# EAGLE schematic flukso.sensor.board.v2.0 (EAGLE 5.04)
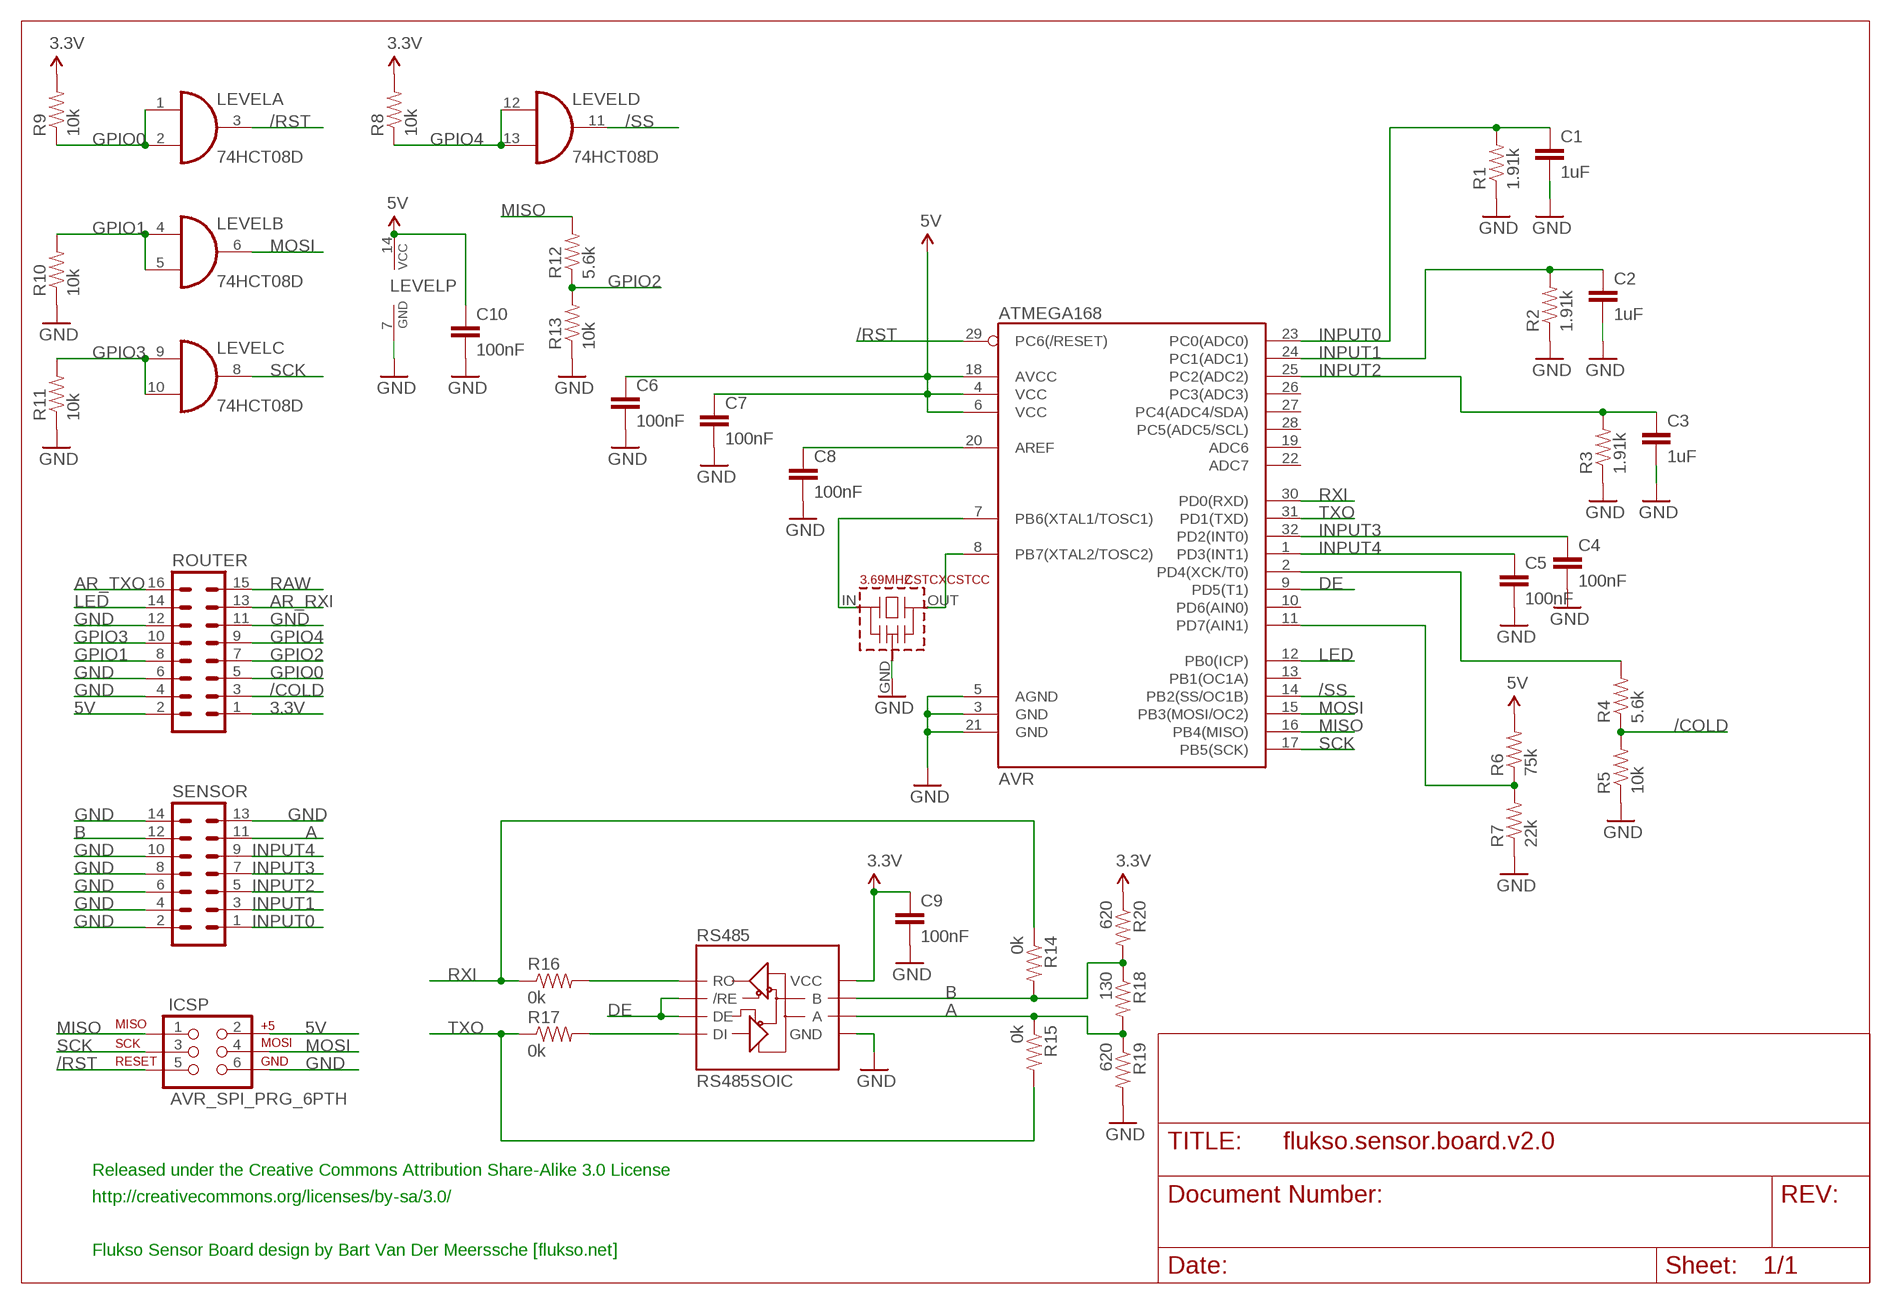
[diagram p0: schematic, sheet 1]

## Parts
3.69MHZ  CSTCXCSTCC  [CSTCC]
AVR  ATMEGA168  [TQFP32-08]
C1  1uF  CAP0402-CAP  [0402-CAP]
C2  1uF  CAP0402-CAP  [0402-CAP]
C3  1uF  CAP0402-CAP  [0402-CAP]
C4  100nF  CAP0402-CAP  [0402-CAP]
C5  100nF  CAP0402-CAP  [0402-CAP]
C6  100nF  CAP0402-CAP  [0402-CAP]
C7  100nF  CAP0402-CAP  [0402-CAP]
C8  100nF  CAP0402-CAP  [0402-CAP]
C9  100nF  CAP0402-CAP  [0402-CAP]
C10  100nF  CAP0402-CAP  [0402-CAP]
ICSP  AVR_SPI_PRG_6PTH  [2X3]
LEVEL  74HCT08D  [SO14]
R1  1.91k  RESISTOR0402-RES  [0402-RES]
R2  1.91k  RESISTOR0402-RES  [0402-RES]
R3  1.91k  RESISTOR0402-RES  [0402-RES]
R4  5.6k  RESISTOR0402-RES  [0402-RES]
R5  10k  RESISTOR0402-RES  [0402-RES]
R6  75k  RESISTOR0402-RES  [0402-RES]
R7  22k  RESISTOR0402-RES  [0402-RES]
R8  10k  RESISTOR0402-RES  [0402-RES]
R9  10k  RESISTOR0402-RES  [0402-RES]
R10  10k  RESISTOR0402-RES  [0402-RES]
R11  10k  RESISTOR0402-RES  [0402-RES]
R12  5.6k  RESISTOR0402-RES  [0402-RES]
R13  10k  RESISTOR0402-RES  [0402-RES]
R14  0k  RESISTOR0402-RES  [0402-RES]
R15  0k  RESISTOR0402-RES  [0402-RES]
R16  0k  RESISTOR0402-RES  [0402-RES]
R17  0k  RESISTOR0402-RES  [0402-RES]
R18  130  RESISTOR0402-RES  [0402-RES]
R19  620  RESISTOR0402-RES  [0402-RES]
R20  620  RESISTOR0402-RES  [0402-RES]
ROUTER  MA08-2  [MA08-2]
RS485  RS485SOIC  [SO08]
SENSOR  MA07-2  [MA07-2]

## Nets
3.3V: C9.1 R8.2 R9.2 R20.1 ROUTER.1 RS485.8(VCC)
5V: AVR.4(VCC) AVR.6(VCC) AVR.18(AVCC) C6.1 C7.1 C10.1 ICSP.2 LEVEL.14(P:VCC) R6.2 ROUTER.2
/COLD: R4.1 R5.2 ROUTER.3
/RST: AVR.29(PC6(/RESET)) ICSP.5 LEVEL.3(A:O)
/SS: AVR.14(PB2(SS/OC1B)) LEVEL.11(D:O)
A: R15.1 R18.2 R19.1 RS485.6(A) SENSOR.11
AR_RXI: ROUTER.13
AR_TXO: ROUTER.16
B: R14.2 R18.1 R20.2 RS485.7(B) SENSOR.12
DE: AVR.9(PD5(T1)) RS485.2(/RE) RS485.3(DE)
GND: 3.69MHZ.GND(VSS) AVR.3(GND) AVR.5(AGND) AVR.21(GND) C1.2 C2.2 C3.2 C4.2 C5.2 C6.2 C7.2 C8.2 C9.2 C10.2 ICSP.6 LEVEL.7(P:GND) R1.1 R2.1 R3.1 R5.1 R7.1 R10.1 R11.1 R13.1 R19.2 ROUTER.4 ROUTER.6 ROUTER.11 ROUTER.12 RS485.5(GND) SENSOR.2 SENSOR.4 SENSOR.6 SENSOR.8 SENSOR.10 SENSOR.13 SENSOR.14
GPIO0: LEVEL.1(A:I0) LEVEL.2(A:I1) R9.1 ROUTER.5
GPIO1: LEVEL.4(B:I0) LEVEL.5(B:I1) R10.2 ROUTER.8
GPIO2: R12.1 R13.2 ROUTER.7
GPIO3: LEVEL.9(C:I0) LEVEL.10(C:I1) R11.2 ROUTER.10
GPIO4: LEVEL.12(D:I0) LEVEL.13(D:I1) R8.1 ROUTER.9
INPUT0: AVR.23(PC0(ADC0)) C1.1 R1.2 SENSOR.1
INPUT1: AVR.24(PC1(ADC1)) C2.1 R2.2 SENSOR.3
INPUT2: AVR.25(PC2(ADC2)) C3.1 R3.2 SENSOR.5
INPUT3: AVR.32(PD2(INT0)) C4.1 SENSOR.7
INPUT4: AVR.1(PD3(INT1)) C5.1 SENSOR.9
LED: AVR.12(PB0(ICP)) ROUTER.14
MISO: AVR.16(PB4(MISO)) ICSP.1 R12.2
MOSI: AVR.15(PB3(MOSI/OC2)) ICSP.4 LEVEL.6(B:O)
N$1: AVR.11(PD7(AIN1)) R6.1 R7.2
N$3: 3.69MHZ.IN AVR.7(PB6(XTAL1/TOSC1))
N$4: 3.69MHZ.OUT AVR.8(PB7(XTAL2/TOSC2))
N$5: AVR.20(AREF) C8.1
N$6: R16.2 RS485.1(RO)
N$7: AVR.2(PD4(XCK/T0)) R4.2
N$8: R17.2 RS485.4(DI)
RAW: ROUTER.15
RXI: AVR.30(PD0(RXD)) R14.1 R16.1
SCK: AVR.17(PB5(SCK)) ICSP.3 LEVEL.8(C:O)
TXO: AVR.31(PD1(TXD)) R15.2 R17.1
Unconnected: AVR.10(PD6(AIN0)) AVR.13(PB1(OC1A)) AVR.19(ADC6) AVR.22(ADC7) AVR.26(PC3(ADC3)) AVR.27(PC4(ADC4/SDA)) AVR.28(PC5(ADC5/SCL))

## Notes on the sheet
- Released under the Creative Commons Attribution Share-Alike 3.0 License
- http://creativecommons.org/licenses/by-sa/3.0/
- Flukso Sensor Board design by Bart Van Der Meerssche [flukso.net]

## Library data of the parts
3.69MHZ = murata-cstcc-cstcv-resonators:CSTCX
AVR = sparkFun:ATMEGA168
C1-C10 = sparkFun:CAP: Capacitor Standard 0603 ceramic capacitor, and 0.1" leaded capacitor.
ICSP = sparkFun:AVR_SPI_PRG_6: AVR ISP 6 Pin This is the reduced ISP connector for AVR programming. Common on Arduino. This footprint will take up less PCB space and can be used with a 10-pin to 6-pin adapter such as SKU: BOB-08508
LEVEL = 74xx-eu:74*08: Quad 2-input AND gate
R1-R20 = sparkFun:RESISTOR: Resistor Basic schematic elements and footprints for 0603, 1206, and PTH 1/10th watt (small) resistors.
ROUTER = con-lstb:MA08-2: PIN HEADER
RS485 = sparkFun:RS485
SENSOR = con-lstb:MA07-2: PIN HEADER